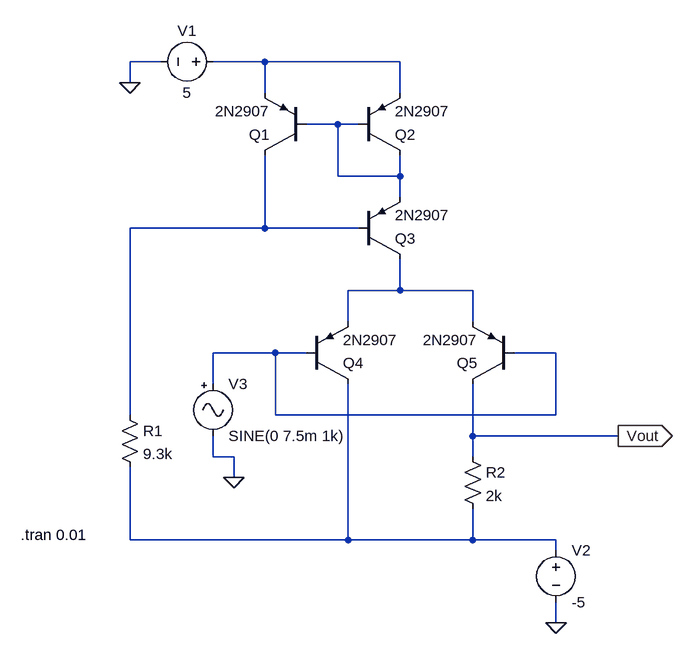
[diagram p0: schematic Draft9.asc]
Draft9.asc, the LTspice schematic file:
Version 4
SHEET 1 880 1056
WIRE 64 176 16 176
WIRE 224 176 144 176
WIRE 432 176 224 176
WIRE 16 208 16 176
WIRE 224 224 224 176
WIRE 432 224 432 176
WIRE 336 272 288 272
WIRE 368 272 336 272
WIRE 336 352 336 272
WIRE 432 352 432 320
WIRE 432 352 336 352
WIRE 432 384 432 352
WIRE 224 432 224 320
WIRE 224 432 16 432
WIRE 368 432 224 432
WIRE 432 528 432 480
WIRE 432 528 352 528
WIRE 544 528 432 528
WIRE 352 576 352 528
WIRE 544 576 544 528
WIRE 240 624 144 624
WIRE 288 624 240 624
WIRE 672 624 608 624
WIRE 144 672 144 624
WIRE 16 720 16 432
WIRE 240 720 240 624
WIRE 672 720 672 624
WIRE 672 720 240 720
WIRE 544 752 544 672
WIRE 768 752 544 752
WIRE 144 784 144 752
WIRE 176 784 144 784
WIRE 544 784 544 752
WIRE 176 816 176 784
WIRE 16 912 16 800
WIRE 352 912 352 672
WIRE 352 912 16 912
WIRE 544 912 544 864
WIRE 544 912 352 912
WIRE 672 912 544 912
WIRE 672 928 672 912
WIRE 672 1040 672 1008
FLAG 672 1040 0
FLAG 16 208 0
FLAG 768 752 Vout
IOPIN 768 752 Out
FLAG 176 816 0
SYMBOL voltage 160 176 R90
WINDOW 0 -32 56 VBottom 2
WINDOW 3 32 56 VTop 2
SYMATTR InstName V1
SYMATTR Value 5
SYMBOL pnp 288 320 R180
SYMATTR InstName Q1
SYMATTR Value 2N2907
SYMBOL pnp 368 320 M180
SYMATTR InstName Q2
SYMATTR Value 2N2907
SYMBOL pnp 368 480 M180
SYMATTR InstName Q3
SYMATTR Value 2N2907
SYMBOL pnp 288 672 M180
SYMATTR InstName Q4
SYMATTR Value 2N2907
SYMBOL pnp 608 672 R180
SYMATTR InstName Q5
SYMATTR Value 2N2907
SYMBOL res 0 704 R0
SYMATTR InstName R1
SYMATTR Value 9.3k
SYMBOL res 528 768 R0
SYMATTR InstName R2
SYMATTR Value 2k
SYMBOL voltage 672 912 R0
SYMATTR InstName V2
SYMATTR Value -5
SYMBOL Misc/signal 144 656 R0
SYMATTR InstName V3
SYMATTR Value SINE(0 7.5m 1k)
TEXT -152 904 Left 2 !.tran 0.01

The netlist it stands for:
* Draft9.asc
V1 N001 0 5
Q1 N003 N002 N001 0 2N2907
Q2 N002 N002 N001 0 2N2907
Q3 N004 N003 N002 0 2N2907
Q4 N006 N005 N004 0 2N2907
Q5 Vout N005 N004 0 2N2907
R1 N003 N006 9.3k
R2 Vout N006 2k
V2 N006 0 -5
V3 N005 0 SINE(0 7.5m 1k)
.model NPN NPN
.model PNP PNP
.lib standard.bjt
.tran 0.01
.backanno
.end